# EAGLE schematic track charger complete (EAGLE 7.2.0)
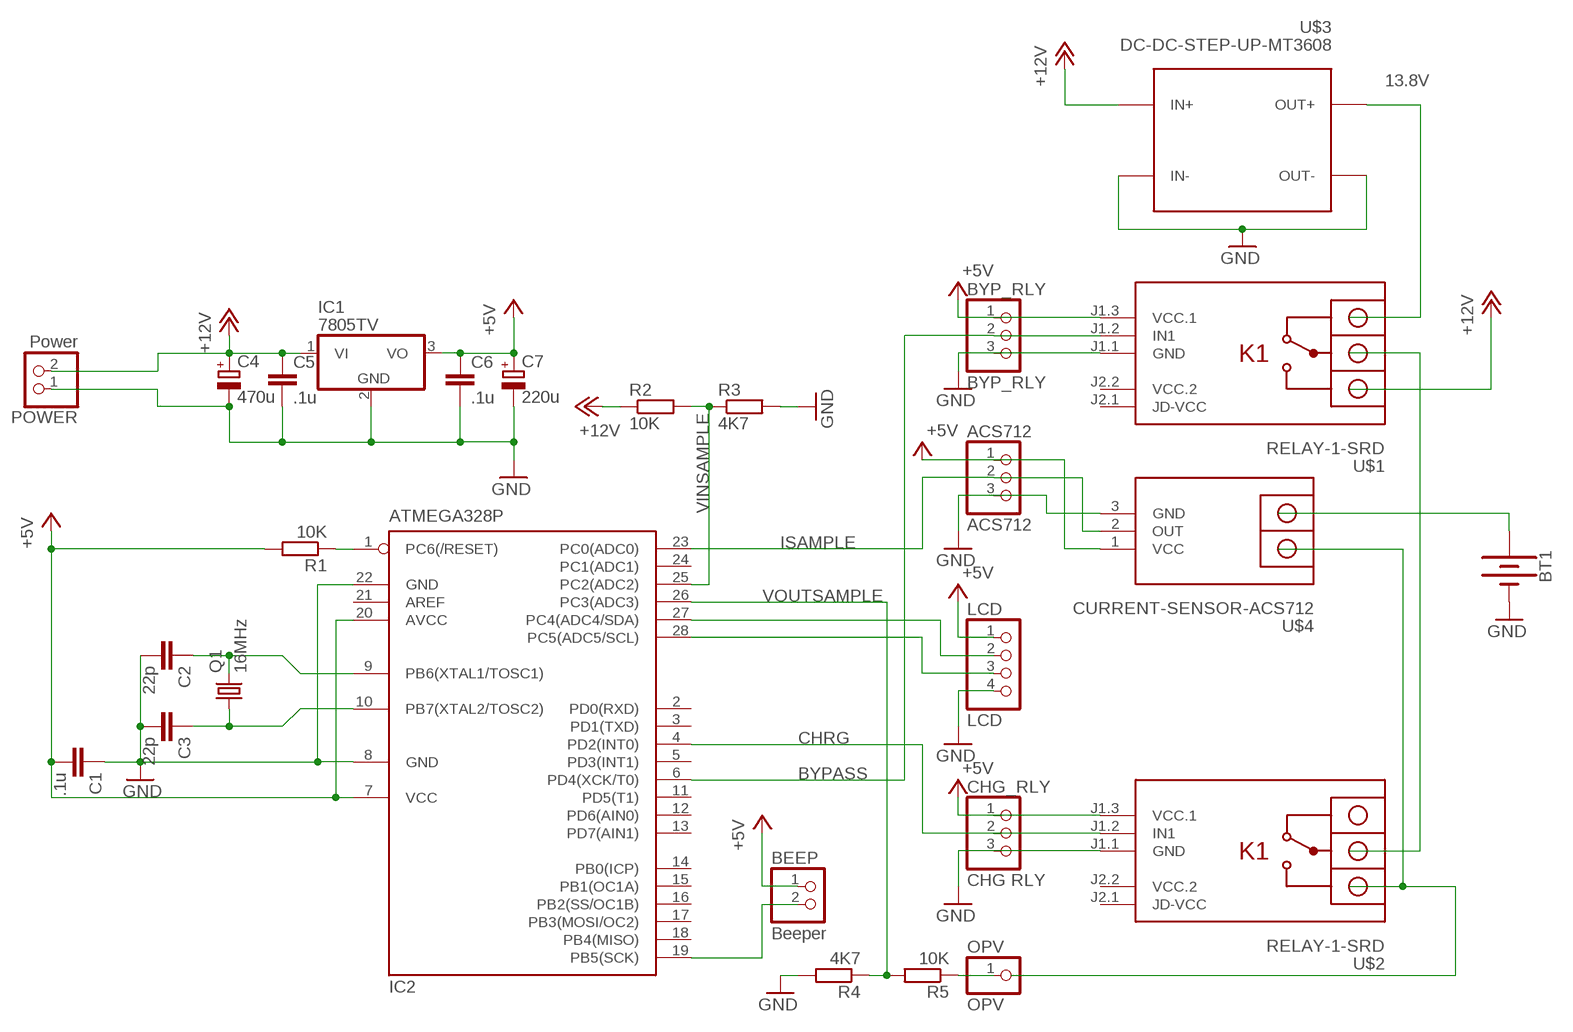
[diagram p0: schematic, sheet 1]

## Parts
ACS712  ACS712  PINHD-1X3  [1X03]
BEEP  Beeper  PINHD-1X2  [1X02]
BT1  BATTERY-12MM_PTH  [BATTCON_12MM_PTH]
BYP_RLY  BYP_RLY  PINHD-1X3  [1X03]
C1  .1u  C-EU025-024X044  [C025-024X044]
C2  22p  C-EU025-024X044  [C025-024X044]
C3  22p  C-EU025-024X044  [C025-024X044]
C4  470u  CPOL-EUE3.5-10  [E3,5-10]
C5  .1u  C-EU025-024X044  [C025-024X044]
C6  .1u  C-EU025-024X044  [C025-024X044]
C7  220u  CPOL-EUE2.5-7  [E2,5-7]
CHG_RLY  CHG RLY  PINHD-1X3  [1X03]
IC1  7805TV  [TO220V]
IC2  ATMEGA328P  MEGA8-P  [DIL28-3]
LCD  LCD  PINHD-1X4  [1X04]
OPV  OPV  PINHD-1X1  [1X01]
POWER  Power  PINHD-1X2  [1X02]
Q1  16MHz  CRYSTALHC18U-V  [HC18U-V]
R1  10K  R-EU_0204/7  [0204/7]
R2  10K  R-EU_0204/7  [0204/7]
R3  4K7  R-EU_0204/7  [0204/7]
R4  4K7  R-EU_0204/7  [0204/7]
R5  10K  R-EU_0204/7  [0204/7]
U$1  RELAY-1-SRD  [RELAY-1-SRD]
U$2  RELAY-1-SRD  [RELAY-1-SRD]
U$3  DC-DC-STEP-UP-MT3608  [DC-DC-STEP-UP-MT3608]
U$4  CURRENT-SENSOR-ACS712  [CURRENT-SENSOR-ACS712]

## Nets
13.8V: U$3.OUT+
+5V: ACS712.1 BEEP.1 BYP_RLY.1 C1.2 C6.1 C7.+ CHG_RLY.1 IC1.3(VO) IC2.7(VCC) IC2.20(AVCC) LCD.1 R1.2 U$1.J1.3(VCC.1) U$2.J1.3(VCC.1) U$4.1(VCC)
+12V: C4.+ C5.1 IC1.1(VI) POWER.2 R2.1 U$3.IN+
BYPASS: BYP_RLY.2 IC2.6(PD4(XCK/T0)) U$1.J1.2(IN1)
CHRG: CHG_RLY.2 IC2.4(PD2(INT0)) U$2.J1.2(IN1)
GND: ACS712.3 BT1.GND(-) BYP_RLY.3 C1.1 C2.2 C3.2 C4.- C5.2 C6.2 C7.- CHG_RLY.3 IC1.2(GND) IC2.8(GND) IC2.22(GND) LCD.4 POWER.1 R3.2 R4.2 U$1.J1.1(GND) U$2.J1.1(GND) U$3.IN- U$3.OUT- U$4.3(GND)
ISAMPLE: ACS712.2 IC2.23(PC0(ADC0)) U$4.2(OUT)
N$1: IC2.27(PC4(ADC4/SDA)) LCD.2
N$2: IC2.28(PC5(ADC5/SCL)) LCD.3
N$3: BT1.VCC@1(+)
N$7: OPV.1 R5.1
N$10: C3.1 IC2.10(PB7(XTAL2/TOSC2)) Q1.1
N$13: BEEP.2 IC2.19(PB5(SCK))
N$16: C2.1 IC2.9(PB6(XTAL1/TOSC1)) Q1.2
N$18: IC2.1(PC6(/RESET)) R1.1
VINSAMPLE: IC2.25(PC2(ADC2)) R2.2 R3.1
VOUTSAMPLE: IC2.26(PC3(ADC3)) R4.1 R5.2
Unconnected: IC2.2(PD0(RXD)) IC2.3(PD1(TXD)) IC2.5(PD3(INT1)) IC2.11(PD5(T1)) IC2.12(PD6(AIN0)) IC2.13(PD7(AIN1)) IC2.14(PB0(ICP)) IC2.15(PB1(OC1A)) IC2.16(PB2(SS/OC1B)) IC2.17(PB3(MOSI/OC2)) IC2.18(PB4(MISO)) IC2.21(AREF) IC2.24(PC1(ADC1)) U$1.J2.1(JD-VCC) U$2.J2.1(JD-VCC)

## Power pins joined to a net without a drawn wire
VCC.2: U$1.J2.2(VCC.2) U$2.J2.2(VCC.2)

## Library data of the parts
ACS712 BYP_RLY CHG_RLY = pinhead:PINHD-1X3: PIN HEADER
BEEP POWER = pinhead:PINHD-1X2: PIN HEADER
BT1 = SparkFun-Batteries:BATTERY: Battery - Single Cell A variety of battery chemistries, sizes, and footprints. Device List: 20MM_PTH - Coin Cell Battery Holder - 20mm (PTH) <https://www.sparkfun.com/products/783> 6.8MM_PTH - Coin Cell Battery Holder - 6.8MM(SMD) <https://www.digikey.com/product-detail/en/seiko-instruments/MS621FE-FL11E/728-1057-ND/1889208?WT.srch=1&gclid=CNOQ5a6LzdQCFZS2wAodXCkE0g> 12MM_SMD - Coin Cell Battery Holder - 12mm (SMD) <https://www.sparkfun.com/products/10592> 12MM_PTH - Coin Cell Battery Holder - 12mm (PTH) <https://www.sparkfun.com/products/7948> 20MM_SMD - 20mm Coin Cell Battery Holder (SMD) (2 legs) Used on the Big Time Watch Kit <https://www.sparkfun.com/products/11734> 20MM_SMD_4LEGS - Coin Cell Battery Holder - 20mm (SMD) <https://www.sparkfun.com/products/11892> 20MM_SMD_4LEGS_OVERPASTE - Coin Cell Battery Holder - 20mm (SMD) <https://www.sparkfun.com/products/11892> (Over-paste on the legs) 24.5MM_PTH - Coin Cell Battery Holder - 24.5mm (PTH) <https://www.sparkfun.com/products/8863> 9V - 9V Battery Holder - PC Mount Used on the SparkFun SparkPunk Sound Kit <https://www.sparkfun.com/products/11177> and SparkFun SparkPunk Sequencer Kit <https://www.sparkfun.com/products/12707> 18650 - Battery Holder - 18650 (PTH) <https://www.sparkfun.com/products/13113> AA - Battery Holder - 1xAA (PTH) <https://www.sparkfun.com/products/7949> AAA - Battery Holder - 1xAAA (PTH) <https://www.sparkfun.com/products/12718> AA_KIT - Battery Holder - 1xAA (PTH) <https://www.sparkfun.com/products/7949> Special kit package - pads only have exposed copper on one side of the board. AAA_KIT - Battery Holder - 1xAAA (PTH) <https://www.sparkfun.com/products/12718> Special kit package - pads only have exposed copper on one side of the board.; PROD_ID: BATT-08315; SF_SKU: PRT-07948
C1-C3 C5 C6 = resistor:C-EU: CAPACITOR, European symbol
C4 C7 = resistor:CPOL-EU: POLARIZED CAPACITOR, European symbol
IC1 = linear:78*: Positive VOLTAGE REGULATOR Source: http://cache.national.com/ds/LM/LM78L05.pdf http://www.fairchildsemi.com/ds/LM/LM7805.pdf
IC2 = atmel:MEGA8-P: MICROCONTROLLER 8 Kbytes FLASH, 1 kbytes SRAM, 512 bytes EEPROM, USART, 4-channel 10 bit ADC, 2-channel 8 bit ADC Pin compatible with Atmega48, ATMega88, ATMega168 Source: avr.lbr; OC_FARNELL: unknown; OC_NEWARK: unknown
LCD = pinhead:PINHD-1X4: PIN HEADER
OPV = pinhead:PINHD-1X1: PIN HEADER
Q1 = crystal:CRYSTAL: CRYSTAL; OC_FARNELL: unknown; OC_NEWARK: unknown
R1-R5 = resistor:R-EU_: RESISTOR, European symbol
U$1 U$2 = diy-modules:RELAY-1-SRD: 1-Channel Relay Module based on SRD-05VDC-SL-C relays Click here to find device on ebay.com <http://www.ebay.com/sch/one+channel+isolated+relay+5v>
U$3 = diy-modules:DC-DC-STEP-UP-MT3608: DC/DC Step-Up Regulator based on MT3608 chip MT3608 datasheet available here: https://www.olimex.com/Products/Breadboarding/BB-PWR-3608/resources/MT3608.pdf Click here to find device on ebay.com <http://www.ebay.com/sch/mt3608+module>
U$4 = diy-modules:CURRENT-SENSOR-ACS712: Isolated Bipolar Current Sensors based on ACS712 chip More details available here: http://embedded-lab.com/blog/a-brief-overview-of-allegro-acs712-current-sensor-part-1/ Click here to find device on ebay.com <http://www.ebay.com/sch/acs712+module> Note: There are many available versions with different pinout. Please check before use